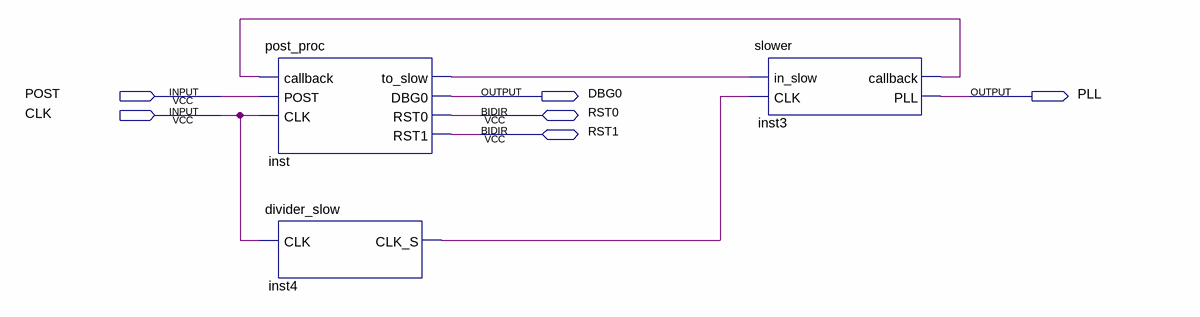
[diagram p0: schematic sheet]
// Quartus schematic main.bdf as structural Verilog: 3 symbols, 6 pins
module main (
  input  POST,
  input  CLK,
  inout  RST0,
  inout  RST1,
  output DBG0,
  output PLL
);

  wire inst3_callback, inst4_clk_s, inst_to_slow;

  post_proc inst (
    .callback(inst3_callback), .POST(POST), .CLK(CLK), .to_slow(inst_to_slow), .DBG0(DBG0), .RST0(RST0),
    .RST1(RST1));
  divider_slow inst4 (.CLK(CLK), .CLK_S(inst4_clk_s));
  slower inst3 (.in_slow(inst_to_slow), .CLK(inst4_clk_s), .callback(inst3_callback), .PLL(PLL));
endmodule
